# EAGLE design vehicle (EAGLE 6.5.0)
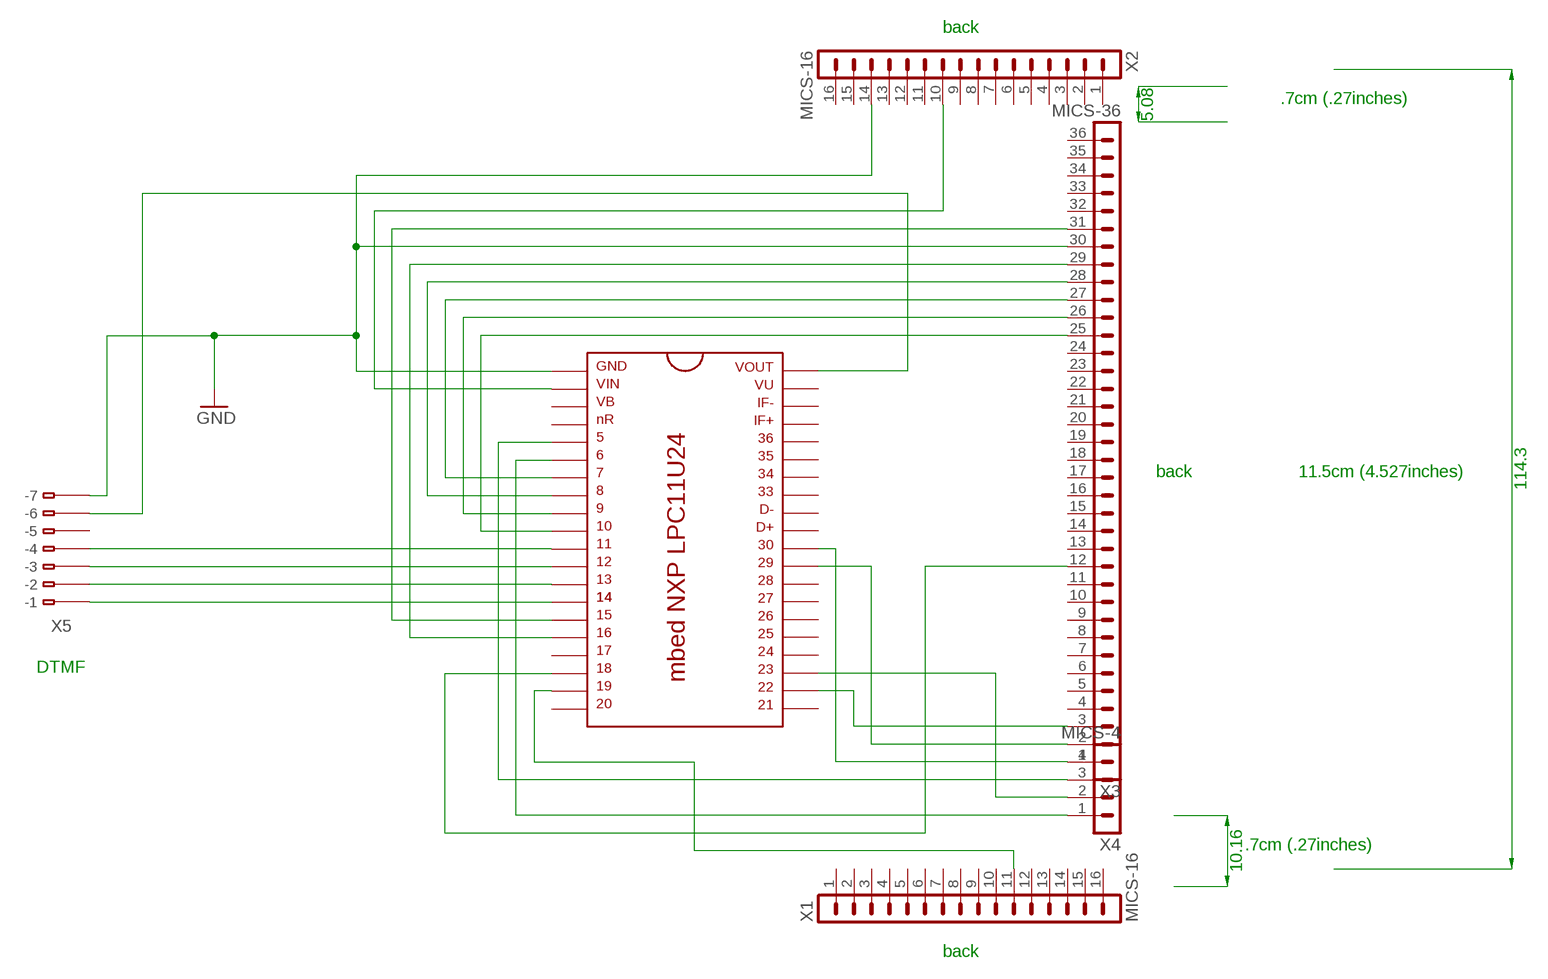
[diagram p0: schematic, sheet 1]

## Parts
IC1  MBED-NXP-LPC11U24  [DIL40_0.9]
X1  MICS-16  [MICS-16]
X2  MICS-16  [MICS-16]
X3  MICS-36  [MICS-36]
X4  MICS-4  [MICS-4]
X5  233-107  [233-107]

## Nets
GND: IC1.1 X2.14 X3.30 X5.B7(B-7)
N$1: IC1.18 X3.12
N$2: IC1.22 X3.3
N$3: IC1.2 X2.10
N$4: IC1.15 X3.31
N$5: IC1.30 X3.1 X4.4
N$6: IC1.16 X3.29
N$7: IC1.8 X3.28
N$8: IC1.7 X3.27
N$9: IC1.9 X3.26
N$10: IC1.10 X3.25
N$11: IC1.29 X3.2
N$12: IC1.5 X4.3
N$13: IC1.23 X4.2
N$14: IC1.6 X4.1
N$16: IC1.19 X1.11
N$17: IC1.40 X5.B6(B-6)
N$18: IC1.11
N$19: IC1.12 X5.B3(B-3)
N$20: IC1.13 X5.B2(B-2)
N$21: IC1.14 X5.B1(B-1)
Unconnected: IC1.3 IC1.4 IC1.17 IC1.20 IC1.21 IC1.24 IC1.25 IC1.26 IC1.27 IC1.28 IC1.31 IC1.32 IC1.33 IC1.34 IC1.35 IC1.36 IC1.37 IC1.38 IC1.39 X1.1 X1.2 X1.3 X1.4 X1.5 X1.6 X1.7 X1.8 X1.9 X1.10 X1.12 X1.13 X1.14 X1.15 X1.16 X2.1 X2.2 X2.3 X2.4 X2.5 X2.6 X2.7 X2.8 X2.9 X2.11 X2.12 X2.13 X2.15 X2.16 X3.4 X3.5 X3.6 X3.7 X3.8 X3.9 X3.10 X3.11 X3.13 X3.14 X3.15 X3.16 X3.17 X3.18 X3.19 X3.20 X3.21 X3.22 X3.23 X3.24 X3.32 X3.33 X3.34 X3.35 X3.36 X5.A1(-1) X5.A2(-2) X5.A3(-3) X5.A4(-4) X5.A5(-5) X5.A6(-6) X5.A7(-7) X5.B4(B-4) X5.B5(B-5)

## Notes on the sheet
- back
- .7cm (.27inches)
- back | 11.5cm (4.527inches)
- DTMF
- .7cm (.27inches)
- back

## Library data of the parts
IC1 = mbed-microcontroller:MBED-NXP-LPC11U24
X1 X2 = con-lumberg:MICS-16: CONNECTOR; OC_FARNELL: unknown; OC_NEWARK: unknown
X3 = con-lumberg:MICS-36: CONNECTOR; OC_FARNELL: 871266; OC_NEWARK: unknown
X4 = con-lumberg:MICS-4: CONNECTOR; OC_FARNELL: unknown; OC_NEWARK: unknown
X5 = con-wago:233-107: WAGO Cage Clamp; MPN: 233-107; OC_FARNELL: unknown; OC_NEWARK: 28K9049

## Board
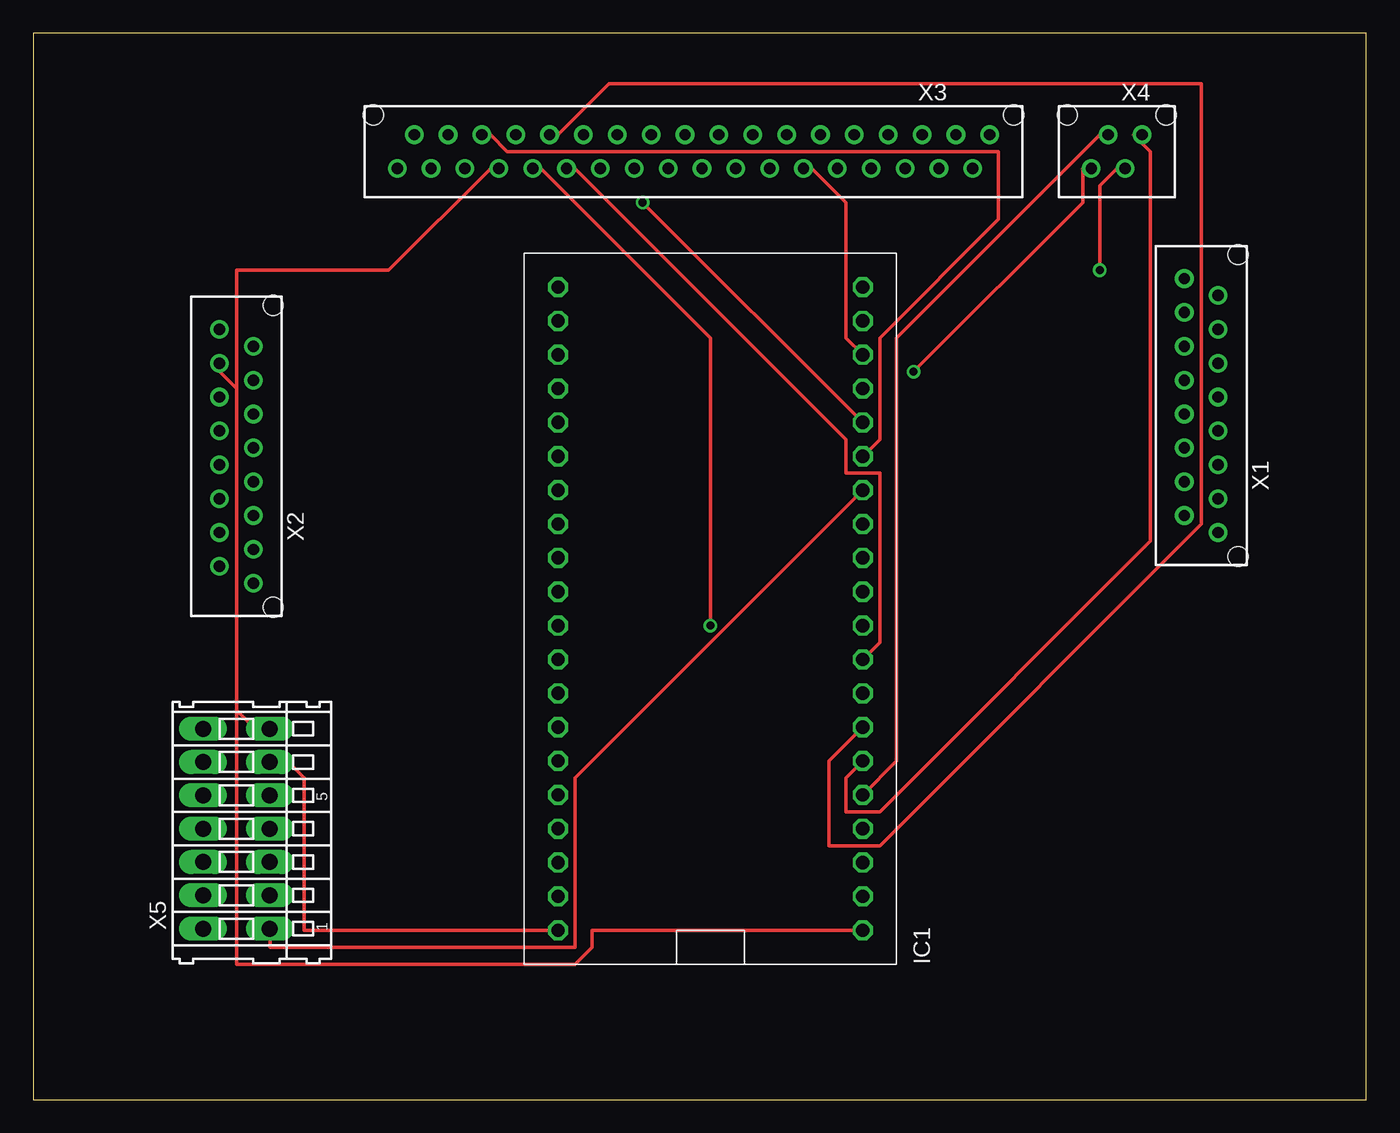
[diagram p1: board, top side]
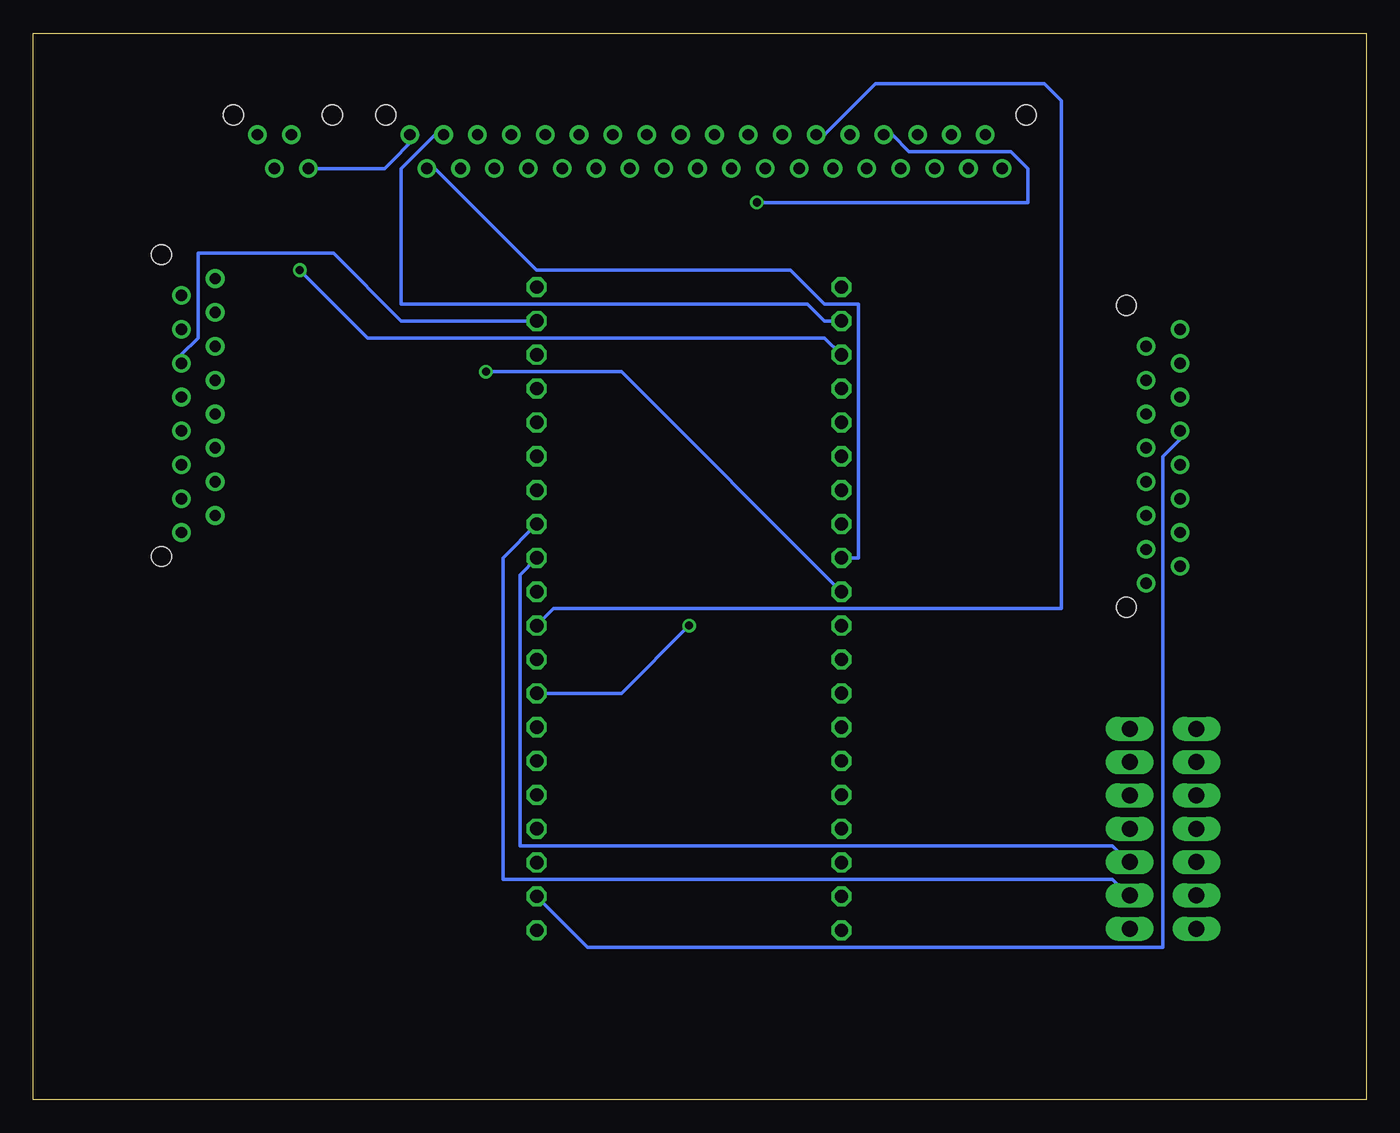
[diagram p2: board, bottom side, seen from below]

Size 100 x 80 mm. Coordinates in mm from the lower left corner, seen from the top.
Outline: 0,0 100,0 100,80 0,80 0,0
Copper layers (1*16): Top 0.035mm / dielectric 1.5mm / Bottom 0.035mm
Design rules "default": minimum track width 10mil, minimum drill 24mil, track to track 8mil, track to pad 8mil, pad to pad 8mil, via to via 8mil, smd to smd 8mil, copper to edge 40mil, drill to drill 8mil, minimum pad ring 10mil, minimum via ring 8mil, stop-mask expansion 4mil, vias tented up to drill 0mil, thermal gap 10mil

### Footprints (pad centres in the part's own frame; a part is rotated, then mirrored left to right if it is on the bottom)
DIL40_0.9 = drill 1 pad 1.397 octagon: 1 -22.86,-11.43; 2 -20.32,-11.43; 3 -17.78,-11.43; 4 -15.24,-11.43; 5 -12.7,-11.43; 6 -10.16,-11.43; 7 -7.62,-11.43; 8 -5.08,-11.43; 9 -2.54,-11.43; 10 0,-11.43; 11 2.54,-11.43; 12 5.08,-11.43; 13 7.62,-11.43; 14 10.16,-11.43; 15 12.7,-11.43; 16 15.24,-11.43; 17 17.78,-11.43; 18 20.32,-11.43; 19 22.86,-11.43; 20 25.4,-11.43; 21 25.4,11.43; 22 22.86,11.43; 23 20.32,11.43; 24 17.78,11.43; 25 15.24,11.43; 26 12.7,11.43; 27 10.16,11.43; 28 7.62,11.43; 29 5.08,11.43; 30 2.54,11.43; 31 0,11.43; 32 -2.54,11.43; 33 -5.08,11.43; 34 -7.62,11.43; 35 -10.16,11.43; 36 -12.7,11.43; 37 -15.24,11.43; 38 -17.78,11.43; 39 -20.32,11.43; 40 -22.86,11.43
MICS-16 = drill 0.85 pad 1.397: 1 -9.525,-1.27; 2 -8.255,1.27; 3 -6.985,-1.27; 4 -5.715,1.27; 5 -4.445,-1.27; 6 -3.175,1.27; 7 -1.905,-1.27; 8 -0.635,1.27; 9 0.635,-1.27; 10 1.905,1.27; 11 3.175,-1.27; 12 4.445,1.27; 13 5.715,-1.27; 14 6.985,1.27; 15 8.255,-1.27; 16 9.525,1.27 | hole 1.5: 11.325,-2.75; -11.325,-2.75
MICS-36 = drill 0.85 pad 1.397: 1 -22.225,-1.27; 2 -20.955,1.27; 3 -19.685,-1.27; 4 -18.415,1.27; 5 -17.145,-1.27; 6 -15.875,1.27; 7 -14.605,-1.27; 8 -13.335,1.27; 9 -12.065,-1.27; 10 -10.795,1.27; 11 -9.525,-1.27; 12 -8.255,1.27; 13 -6.985,-1.27; 14 -5.715,1.27; 15 -4.445,-1.27; 16 -3.175,1.27; 17 -1.905,-1.27; 18 -0.635,1.27; 19 0.635,-1.27; 20 1.905,1.27; 21 3.175,-1.27; 22 4.445,1.27; 23 5.715,-1.27; 24 6.985,1.27; 25 8.255,-1.27; 26 9.525,1.27; 27 10.795,-1.27; 28 12.065,1.27; 29 13.335,-1.27; 30 14.605,1.27; 31 15.875,-1.27; 32 17.145,1.27; 33 18.415,-1.27; 34 19.685,1.27; 35 20.955,-1.27; 36 22.225,1.27 | hole 1.5: 24.025,-2.75; -24.025,-2.75
MICS-4 = drill 0.85 pad 1.397: 1 -1.905,-1.27; 2 -0.635,1.27; 3 0.635,-1.27; 4 1.905,1.27 | hole 1.5: 3.705,-2.75; -3.705,-2.75
233-107 = drill 1.2 long: A1 -7.5,2.5; A2 -5,2.5; A3 -2.5,2.5; A4 0,2.5; A5 2.5,2.5; A6 5,2.5; A7 7.5,2.5; B1 -7.5,-2.5; B2 -5,-2.5; B3 -2.5,-2.5; B4 0,-2.5; B5 2.5,-2.5; B6 5,-2.5; B7 7.5,-2.5

### Placement (x,y rotation side)
IC1  50.8,35.56 90 top
X1  87.63,52.07 90 top
X2  15.24,48.26 90 top
X3  49.53,71.12 180 top
X4  81.28,71.12 180 top
X5  15.24,20.32 90 top

### Tracks (layer width: path | path; a pad name or v marks a point on that pad's centre or on a via)
GND
  Top 0.254: 15.24,53.34 13.97,54.61 X2.14 | 15.24,29.21 15.24,53.34 | 15.24,29.21 16.51,27.94 X5.B7 | 15.24,53.34 15.24,62.23 26.67,62.23 34.29,69.85 X3.30 | IC1.1 41.91,12.7 41.91,11.43 40.64,10.16 15.24,10.16 15.24,29.21
N$1
  Top 0.254: IC1.18 60.96,57.15 60.96,67.31 58.42,69.85 X3.12
N$2
  Bottom 0.254: IC1.22 40.64,58.42 41.91,59.69 72.39,59.69 72.39,69.85 69.85,72.39 X3.3
N$3
  Bottom 0.254: IC1.2 58.42,11.43 15.24,11.43 15.24,48.26 13.97,49.53 X2.10
N$4
  Top 0.254: IC1.15 63.5,49.53 63.5,57.15 72.39,66.04 72.39,71.12 35.56,71.12 34.29,72.39 X3.31
N$5  (via drill 0.61)
  Top 0.254: v66.04,54.61 78.74,67.31 78.74,69.85 X4.4
  Bottom 0.254: X4.4 73.66,69.85 71.12,72.39 X3.1 | IC1.30 55.88,54.61 v66.04,54.61
N$6  (via drill 0.61)
  Top 0.254: IC1.16 v45.72,67.31
  Bottom 0.254: v45.72,67.31 25.4,67.31 25.4,69.85 26.67,71.12 34.29,71.12 35.56,72.39 X3.29
N$7  (via drill 0.61)
  Top 0.254: v50.8,35.56 50.8,57.15 38.1,69.85 X3.28
  Bottom 0.254: v50.8,35.56 55.88,30.48 IC1.8
N$8
  Top 0.254: IC1.7 59.69,25.4 59.69,19.05 63.5,19.05 87.63,43.18 87.63,76.2 43.18,76.2 39.37,72.39 X3.27
N$9
  Top 0.254: IC1.9 63.5,34.29 63.5,46.99 60.96,46.99 60.96,49.53 40.64,69.85 X3.26
N$10
  Bottom 0.254: IC1.10 60.96,36.83 22.86,36.83 22.86,74.93 24.13,76.2 36.83,76.2 40.64,72.39 X3.25
N$11
  Bottom 0.254: IC1.29 38.1,40.64 38.1,59.69 40.64,59.69 43.18,62.23 62.23,62.23 69.85,69.85 X3.2
N$12
  Top 0.254: IC1.5 64.77,25.4 64.77,57.15 80.01,72.39 X4.3
N$13  (via drill 0.61)
  Top 0.254: v80.01,62.23 80.01,68.58 81.28,69.85 X4.2
  Bottom 0.254: v80.01,62.23 74.93,57.15 40.64,57.15 IC1.23
N$14
  Top 0.254: IC1.6 60.96,24.13 60.96,21.59 63.5,21.59 83.82,41.91 83.82,71.12 82.55,72.39 X4.1
N$16
  Bottom 0.254: IC1.19 72.39,58.42 77.47,63.5 87.63,63.5 87.63,57.15 88.9,55.88 X1.11
N$17
  Top 0.254: IC1.40 20.32,12.7 20.32,24.13 19.05,25.4 17.78,25.4 X5.B6
N$19
  Bottom 0.254: IC1.12 63.5,39.37 63.5,19.05 19.05,19.05 17.78,17.78 X5.B3
N$20
  Bottom 0.254: IC1.13 64.77,40.64 64.77,16.51 19.05,16.51 17.78,15.24 X5.B2
N$21
  Top 0.254: IC1.14 40.64,24.13 40.64,11.43 17.78,11.43 17.78,12.7 X5.B1